# EAGLE design Safety Valve (EAGLE 9.5.2)

## Sheet 1 of 2
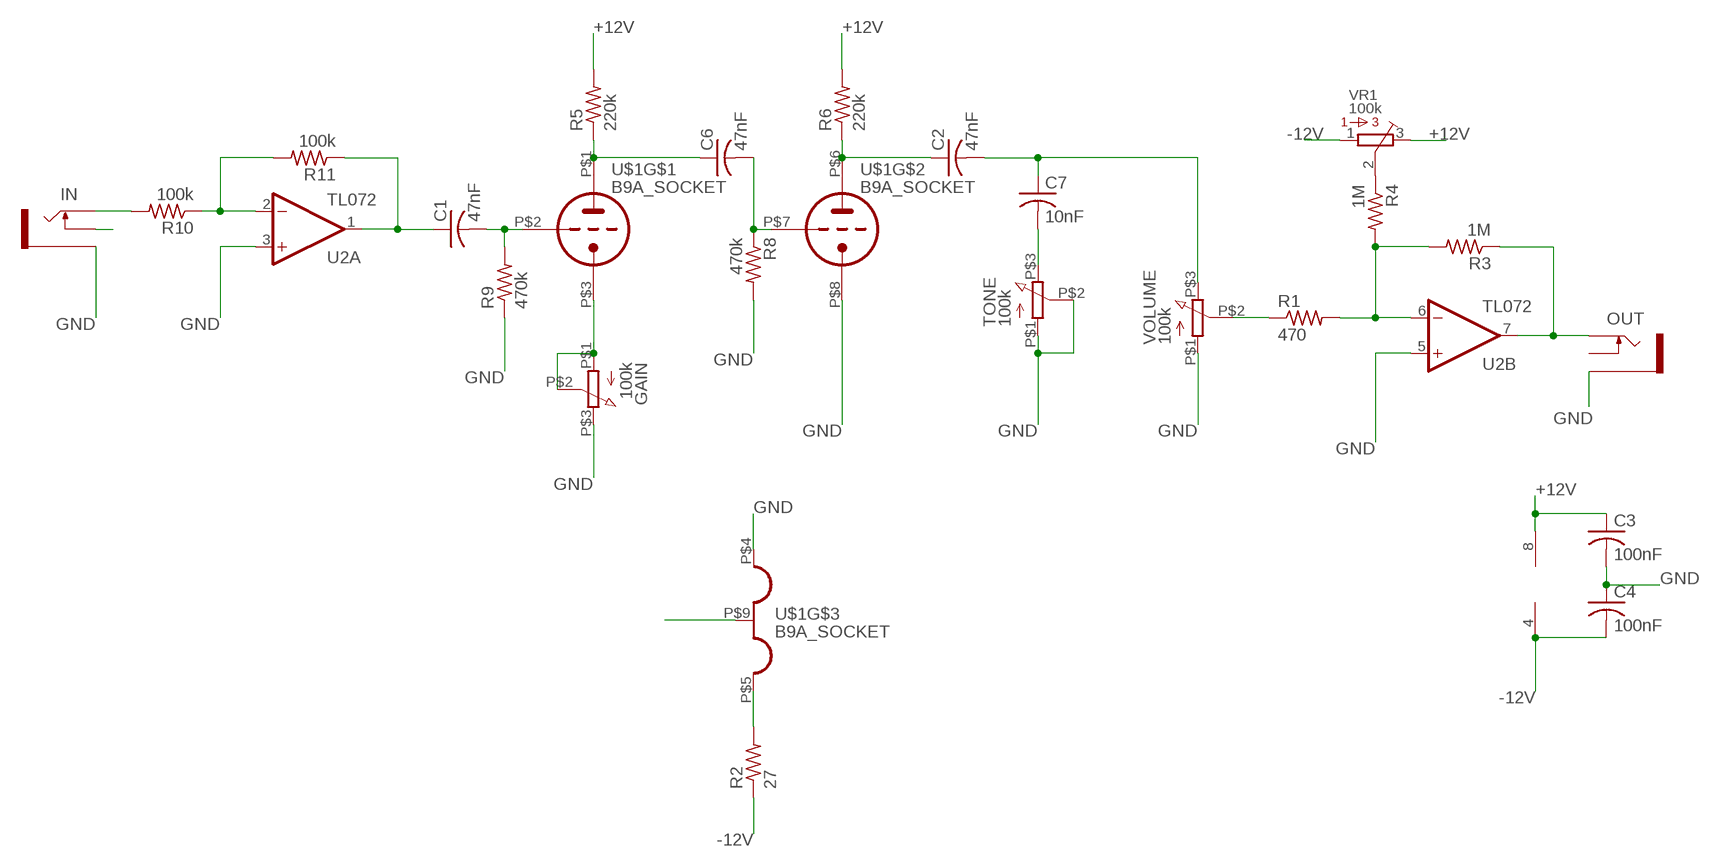
[diagram p0: schematic, sheet 1]

### Parts
C1  47nF  CAPACITOR-US025-024X044  [C025-024X044]
C2  47nF  CAPACITOR-US025-024X044  [C025-024X044]
C3  100nF  CAPACITOR-US025-024X044  [C025-024X044]
C4  100nF  CAPACITOR-US025-024X044  [C025-024X044]
C6  47nF  CAPACITOR-US025-024X044  [C025-024X044]
C7  10nF  CAPACITOR-US050-024X044  [C050-024X044]
GAIN  100k  RESISTOR_VARIABLE9MM_POT  [POTENTIOMETER_9MM]
IN  SOCKET_MONO_3.5MMPJ301M-12  [PJ301M-12]
OUT  SOCKET_MONO_3.5MMPJ301M-12  [PJ301M-12]
R1  470  RESISTOR_US0207/10  [0207/10]
R2  27  R-US_0207/15  [0207/15]
R3  1M  RESISTOR_US0207/10  [0207/10]
R4  1M  RESISTOR_US0207/10  [0207/10]
R5  220k  RESISTOR_US0207/10  [0207/10]
R6  220k  RESISTOR_US0207/10  [0207/10]
R8  470k  RESISTOR_US0207/10  [0207/10]
R9  470k  RESISTOR_US0207/10  [0207/10]
R10  100k  RESISTOR_US0207/10  [0207/10]
R11  100k  RESISTOR_US0207/10  [0207/10]
TONE  100k  RESISTOR_VARIABLE9MM_POT  [POTENTIOMETER_9MM]
U2  TL072  [DIL08-SML]
U$1  B9A_SOCKET  [B9A_SOCKET]
VOLUME  100k  RESISTOR_VARIABLE9MM_POT  [POTENTIOMETER_9MM]
VR1  100k  BOURNS_3362P_TRIMMERP  [BOURNS_3362P_TRIMMER]

### Nets
+12V: C3.1 R5.2 R6.2 U2.8(P:V+) VR1.3 ; also sheet 2
-12V: C4.2 R2.1 U2.4(P:V-) VR1.1 ; also sheet 2
GND: C3.2 C4.1 GAIN.P$3 IN.GND(SLEEVE) OUT.GND(SLEEVE) R8.2 R9.1 TONE.P$1 TONE.P$2 U2.3(A:+IN) U2.5(B:+IN) U$1.P$4(H1) U$1.P$8(TK) VOLUME.P$1 ; also sheet 2
N$1: GAIN.P$1 GAIN.P$2 U$1.P$3(TK)
N$2: R1.2 R3.2 R4.2 U2.6(B:-IN)
N$3: C2.2 C7.1 VOLUME.P$3
N$4: OUT.TIP R3.1 U2.7(B:OUT)
N$5: C2.1 R6.1 U$1.P$6(TA)
N$6: C6.1 R5.1 U$1.P$1(TA)
N$7: C1.2 R9.2 U$1.P$2(TG)
N$8: IN.NORM(SWITCH)
N$9: R4.1 VR1.2
N$10: C1.1 R11.1 U2.1(A:OUT)
N$11: R2.2 U$1.P$5(H3)
N$12: C6.2 R8.1 U$1.P$7(TG)
N$14: IN.TIP R10.2
N$15: U$1.P$9(H2)
N$17: C7.2 TONE.P$3
N$18: R10.1 R11.2 U2.2(A:-IN)
N$19: R1.1 VOLUME.P$2
Unconnected: OUT.NORM(SWITCH)

## Sheet 2 of 2: Power
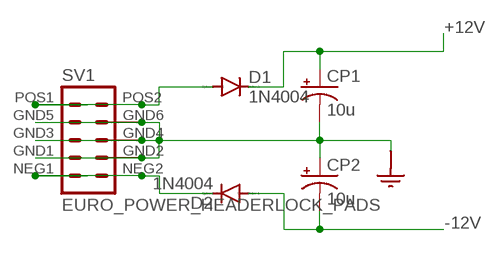
[diagram p1: schematic, sheet 2]

### Parts
CP1  10u  CAPACITOR_POL-USSANYO_D  [SANYO-OSCON_D]
CP2  10u  CAPACITOR_POL-USSANYO_D  [SANYO-OSCON_D]
D1  1N4004  [DO41-10]
D2  1N4004  [DO41-10]
SV1  EURO_POWER_HEADERLOCK_PADS  [EURO_PWR_HEADER_LOCK]

### Nets
+12V: CP1.+ D1.C ; also sheet 1
-12V: CP2.- D2.A ; also sheet 1
GND: CP1.- CP2.+ SV1.GND1 SV1.GND2 SV1.GND3 SV1.GND4 SV1.GND5 SV1.GND6 ; also sheet 1
N$13: D1.A SV1.POS1 SV1.POS2
N$16: D2.C SV1.NEG1 SV1.NEG2

## Library data of the parts
C1-C4 C6 C7 = GMSN:CAPACITOR-US: CAPACITOR, American symbol; SPICEPREFIX: C
CP1 CP2 = GMSN:CAPACITOR_POL-US: POLARIZED CAPACITOR, American symbol; SPICEPREFIX: C
D1 D2 = diode:1N4004: DIODE general purpose rectifier, 1 A
GAIN TONE VOLUME = GMSN:RESISTOR_VARIABLE; SPICEPREFIX: X
IN = GMSN:SOCKET_MONO_3.5MM: 3.5 mm jack socket; SPICEMODEL: SocketMonoSigIn; SPICEPREFIX: X
OUT = GMSN:SOCKET_MONO_3.5MM: 3.5 mm jack socket; SPICEMODEL: SocketMono; SPICEPREFIX: X
R1 R3-R6 R8-R11 = GMSN:RESISTOR_US: RESISTOR, American symbol; SPICEPREFIX: R
R2 = rcl:R-US_: RESISTOR, American symbol; SPICEPREFIX: R
SV1 = MusicThingModular:EURO_POWER_HEADER: Power Header 10 pin power header for Eurorack Power Supplies Variants with fatter pads for easier soldering, and the LOCK variant which has 5mil offset pins to hold the component in place before soldering
U2 = MusicThingModular:TL072: Generic Dual Op Amp
U$1 = varian:B9A_SOCKET
VR1 = MusicThingModular:BOURNS_3362P_TRIMMER: 3362 Series 1/4" Square Trimmer

## Board
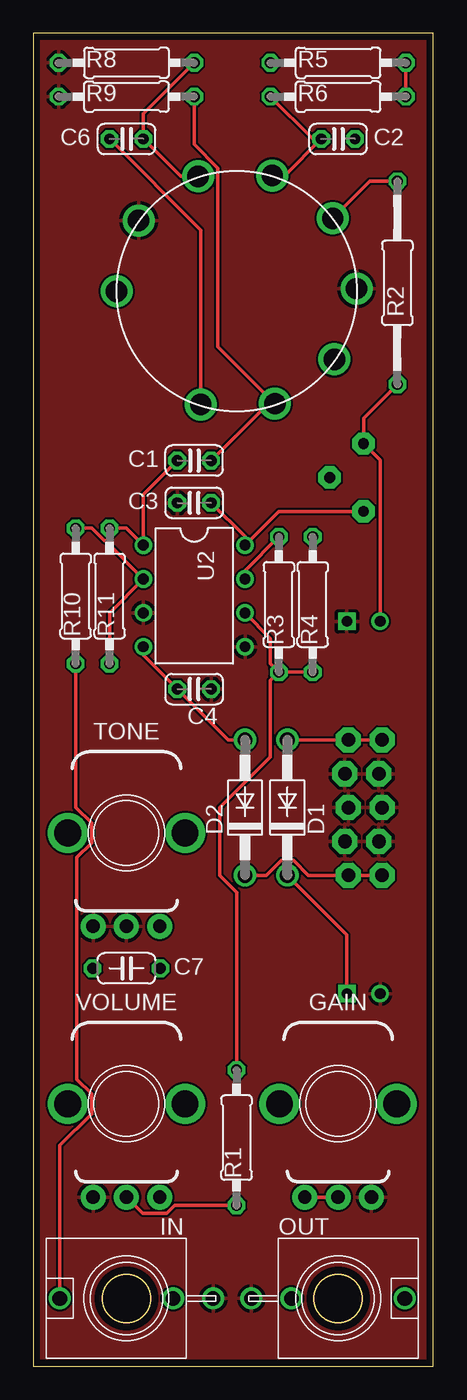
[diagram p2: board, top side]
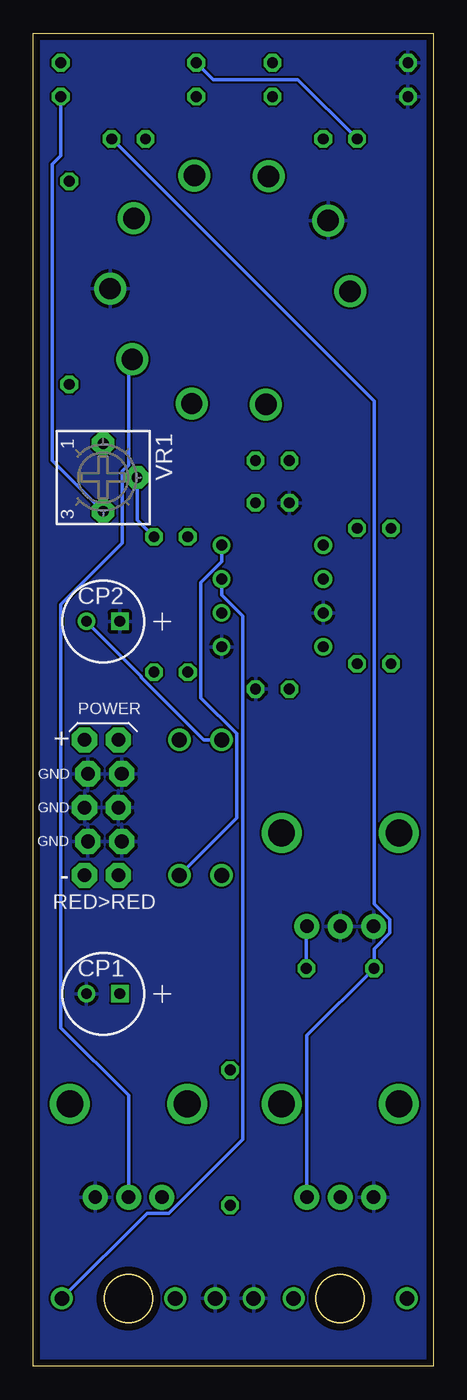
[diagram p3: board, bottom side, seen from below]

Size 30 x 100 mm. Coordinates in mm from the lower left corner, seen from the top.
Outline: 0,0 30,0 30,100 0,100 0,0
Copper layers (1*16): Top 0.035mm / dielectric 1.5mm / Bottom 0.035mm
Design rules "default *": minimum track width 6mil, minimum drill 0.35mm, track to track 6mil, track to pad 6mil, pad to pad 6mil, via to via 6mil, smd to smd 6mil, copper to edge 20mil, drill to drill 6mil, minimum pad ring 10mil, minimum via ring 8mil, stop-mask expansion 4mil, vias tented up to drill 0mil, thermal gap 10mil

### Footprints (pad centres in the part's own frame; a part is rotated, then mirrored left to right if it is on the bottom)
C025-024X044 = drill 0.813 octagon: 1 -1.27,0; 2 1.27,0
C050-024X044 = drill 0.813 octagon: 1 -2.54,0; 2 2.54,0
SANYO-OSCON_D = drill 0.8 pad 1.27 square: + 1.25,0 | drill 0.8 pad 1.27: - -1.25,0
DO41-10 = drill 1.118: A 5.08,0; C -5.08,0
POTENTIOMETER_9MM = drill 1 pad 1.88: P$1 -2.5,-7; P$2 0,-7; P$3 2.5,-7 | drill 2 pad 2.68: P$4 -4.4,0; P$5 4.4,0
PJ301M-12 = drill 1.1: GND 0,-6.5; NORM 0,-3.5; TIP 0,5
0207/10 = drill 0.813 octagon: 1 -5.08,0; 2 5.08,0
0207/15 = drill 0.813 octagon: 1 -7.62,0; 2 7.62,0
EURO_PWR_HEADER_LOCK = drill 1.016 pad 1.88 octagon: GND1 -2.54,1.143; GND2 -2.54,-1.397; GND3 0,1.397; GND4 0,-1.143; GND5 2.54,1.143; GND6 2.54,-1.397; NEG1 -5.08,1.397; NEG2 -5.08,-1.143; POS1 5.08,1.397; POS2 5.08,-1.143
DIL08-SML = drill 0.813 pad 1.27: 1 -3.81,-3.81; 2 -1.27,-3.81; 3 1.27,-3.81; 4 3.81,-3.81; 5 3.81,3.81; 6 1.27,3.81; 7 -1.27,3.81; 8 -3.81,3.81
B9A_SOCKET = drill 1.6: P$1 -8.489,2.685; P$2 -8.427,-2.878; P$3 -5.107,-7.341; P$4 0.203,-9; P$5 5.474,-7.222; P$6 8.692,-2.685; P$7 8.63,2.878; P$8 5.309,7.341; P$9 0,9
BOURNS_3362P_TRIMMER = drill 0.813 pad 1.676 octagon: 1 -2.54,0; 2 0,2.54; 3 2.54,0

### Placement (x,y rotation side)
C1  12.06,67.94 0 top
C2  22.86,92.08 0 top
C3  12.06,64.77 180 top
C4  12.06,50.8 180 top
C6  6.99,92.08 0 top
C7  6.99,29.84 0 top
CP1  24.77,27.94 0 bottom
CP2  24.77,55.88 0 bottom
D1  19.05,41.91 90 top
D2  15.88,41.91 90 top
GAIN  22.86,19.68 0 top
IN  6.99,5.08 90 top
OUT  22.86,5.08 270 top
R1  15.24,17.14 90 top
R2  27.3,81.28 90 top
R3  18.41,57.15 270 top
R4  20.95,57.15 270 top
R5  22.86,97.79 0 top
R6  22.86,95.25 0 top
R8  6.99,97.79 180 top
R9  6.99,95.25 0 top
R10  3.17,57.78 270 top
R11  5.71,57.78 270 top
SV1  24.77,41.91 90 bottom
TONE  6.99,40.01 0 top
U2  12.06,57.78 270 top
U$1  15.24,80.64 90 top
VOLUME  6.99,19.68 0 top
VR1  24.77,66.67 270 bottom

### Tracks (layer width: path | path; a pad name or v marks a point on that pad's centre or on a via)
+12V
  Top 0.254: C3.1 15.88,62.23 U2.8 18.41,64.14 VR1.3 | R5.2 R6.2 | D1.C 23.52,32.37 CP1.+
  Bottom 0.254: R6.2 27.94,90.81 28.57,90.17 28.57,67.94 VR1.3 | U2.8 15.88,60.38 17.45,58.81 17.45,50.15 14.76,47.45 14.76,41.12 D1.C
-12V
  Top 0.254: R2.1 24.77,71.12 VR1.1 26.02,67.97 CP2.- | D2.A 14.61,46.99 C4.2 8.26,53.34 U2.4
  Bottom 0.254: CP2.- 21.89,51.76 21.89,51.68 17.2,46.99 D2.A
GND
  pour Top: -5.08,-3.81 34.29,-3.81 34.29,101.6 33.02,102.87 -2.54,102.87 -3.81,101.6 -3.81,-2.54
  pour Bottom: -7.62,-7.62 36.83,-7.62 36.83,102.87 33.02,106.68 -5.08,106.68 -7.62,104.14
N$1
  Top 0.254: GAIN.P$2 GAIN.P$1
  Bottom 0.254: GAIN.P$2 22.86,20.32 27.94,25.4 27.94,57.15 23.34,61.75 23.34,67.14 22.86,67.62 22.86,75.26 U$1.P$3
N$2
  Top 0.254: R4.2 R3.2 | R3.2 17.78,52.7 17.78,54.61 U2.6 | R1.2 15.24,35.56 13.97,36.83 13.97,41.91 17.78,45.72 17.78,51.44 R3.2
N$3
  Bottom 0.254: VOLUME.P$3 9.48,24.8 C7.1 4.45,31.32 3.27,32.5 3.27,33.51 4.45,34.69 4.45,72.39 C2.2
N$4
  Top 0.254: U2.7 15.88,59.69 R3.1
  Bottom 0.254: U2.7 15.88,57.84 14.3,56.27 14.3,17.02 19.86,11.47 21.47,11.47 OUT.TIP
N$5
  Top 0.254: U$1.P$6 18.85,89.34 C2.1 20.95,92.08 R6.1
N$6
  Top 0.254: U$1.P$1 12.55,85.23 C6.1
  Bottom 0.254: C6.1 10.16,96.52 16.51,96.52 R5.1
N$7
  Top 0.254: C1.2 17.61,72.22 U$1.P$2 13.84,76.49 13.84,89.89 12.06,91.66 R9.2
N$9
  Bottom 0.254: R4.1 22.23,63.5 VR1.2
N$10
  Top 0.254: C1.1 8.26,65.41 U2.1 6.99,62.87 R11.1
N$11
  Top 0.254: U$1.P$5 25.24,88.9 R2.2
N$12
  Top 0.254: U$1.P$7 11.05,89.28 C6.2 8.26,93.98 R8.1
N$13
  Top 0.254: SV1.POS1 SV1.POS2 D1.A
N$14
  Top 0.254: IN.TIP 1.99,16.57 4.36,18.95 4.36,20.42 3.27,21.52 3.27,38.17 4.36,39.27 4.36,40.74 3.17,41.93 R10.2
N$16
  Top 0.254: SV1.NEG1 SV1.NEG2 20.63,36.83 19.51,37.95 18.59,37.95 17.47,36.83 D2.C
N$17
  Bottom 0.254: C7.2 9.53,32.97 TONE.P$3
N$18
  Top 0.254: R10.1 4.39,62.87 5.33,61.92 5.38,61.92 U2.2 5.71,56.52 R11.2
N$19
  Top 0.254: R1.1 10.59,12.06 9.99,11.47 8.2,11.47 VOLUME.P$2